# Altium project GameBoard_V1I1.PrjPcb (part 20 of 20)
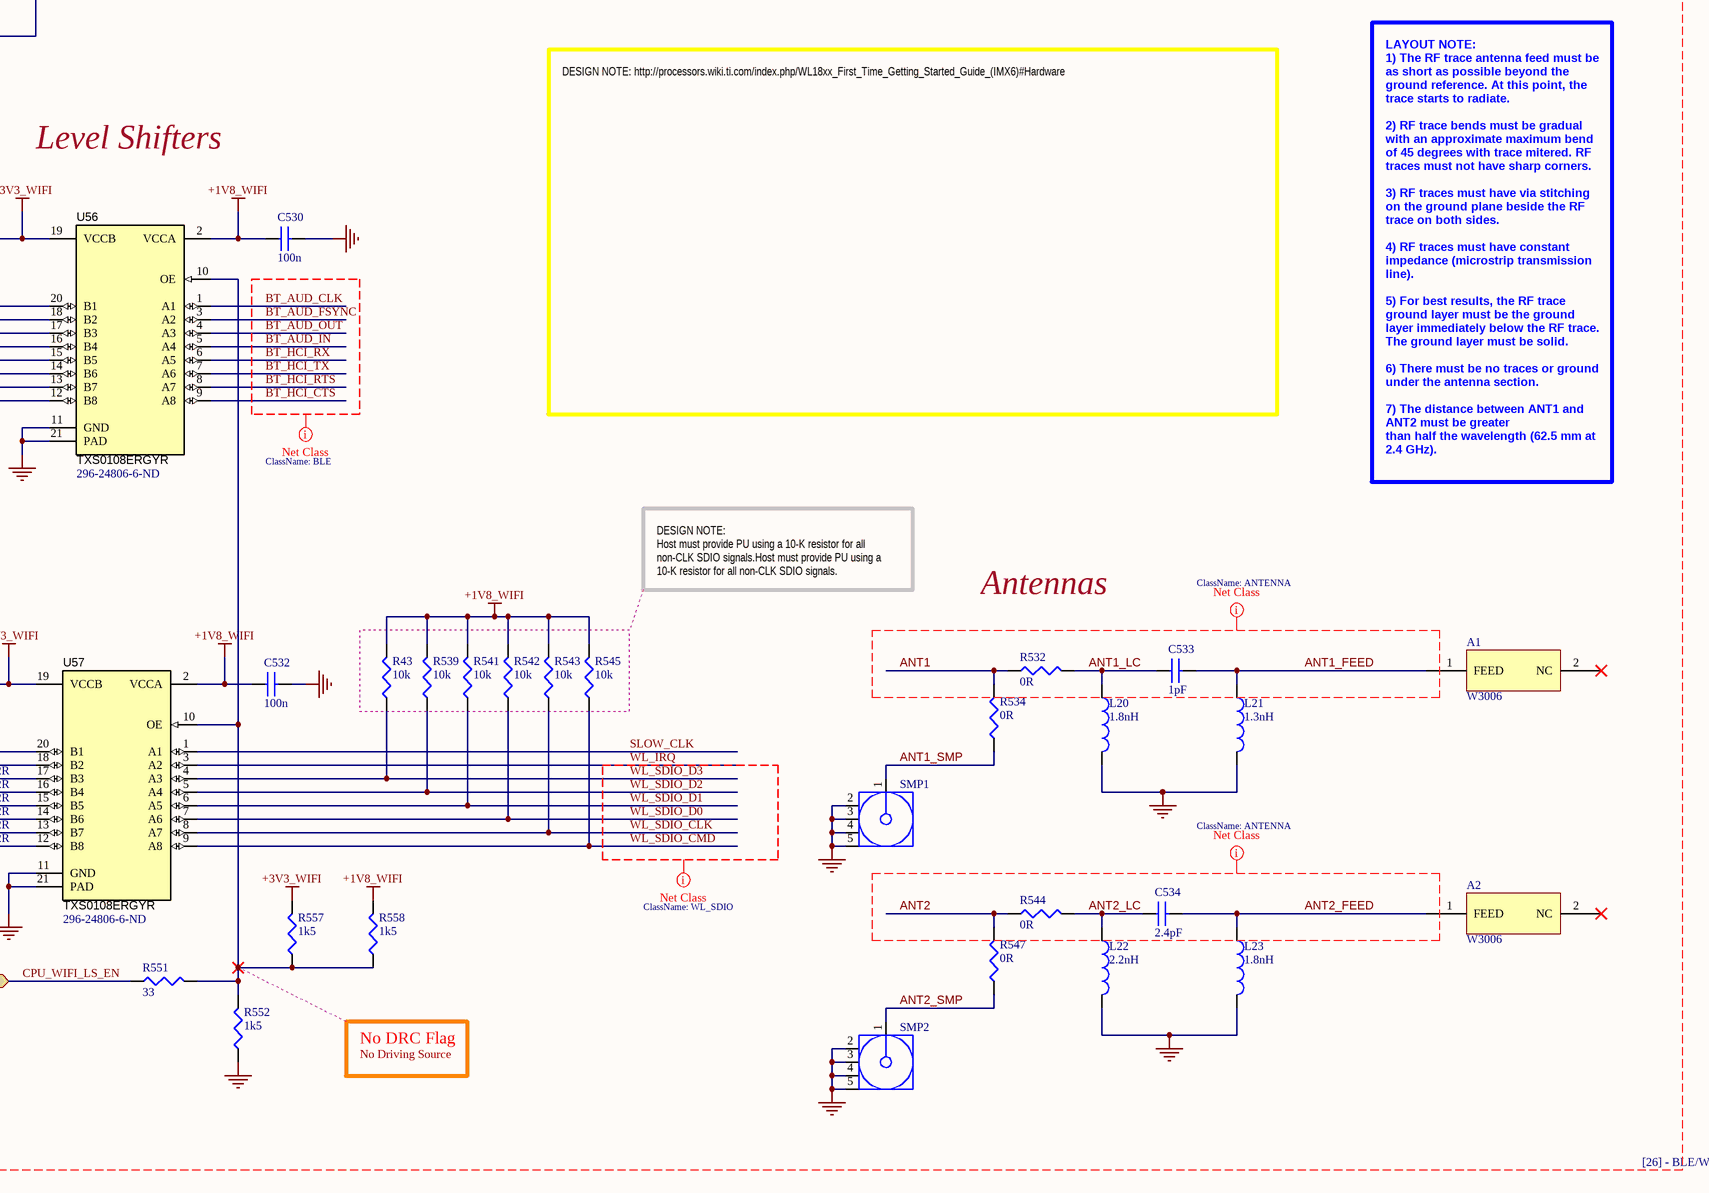
[diagram p96: [26] - BLE, WIFI.SchDoc, bottom right]

## Nets that join several sheets
+1V1_VDDSOC_CAP: [04] - CPU - PCIE, USB (C60.1 FB1.1 R12.1), [05] - CPU - HDMI, LVDS (C72.1 R22.1), [06] - CPU - ETHERNET, SATA (R39.1), [12] - CPU - POWER (16 pins)
+1V2_PMIC: [15] - ETHERNET PHY (R118.2), [30] - PWR PMIC (C419.1 TP27.1 U44.18)
+1V5_DDR: [03] - CPU - DDR3, DDR3 MEM (134 pins), [11] - CPU - JTAG, CONTROL (R90.2), [12] - CPU - POWER (13 pins), [18] - PCIE MINI (FB9.2), [30] - PWR PMIC (10 pins), [21] - AUDIO (FB17.1)
+1V8_AUDIO: [30] - PWR PMIC (C421.1 TP28.1 U44.26), [21] - AUDIO (FB16.2 FB18.2)
+1V375_CORE: [12] - CPU - POWER (28 pins), [15] - ETHERNET PHY (FB2.1), [30] - PWR PMIC (7 pins), [28] - PWR 1V375 OPT, 3V3 OPT (R299.2)
+1V375_SOC: [12] - CPU - POWER (21 pins), [30] - PWR PMIC (6 pins), [28] - PWR 1V375 OPT, 3V3 OPT (5 pins)
+2V5: [04] - CPU - PCIE, USB (C63.1 R13.1), [05] - CPU - HDMI, LVDS (C75.1 R27.1 R32.1), [06] - CPU - ETHERNET, SATA (C92.1 R40.1), [12] - CPU - POWER (C169.1 R114.2 R115.2 R116.2), [15] - ETHERNET PHY (FB6.1), [30] - PWR PMIC (C422.1 TP29.1 U44.28)
+3V0_ALWAYS: [11] - CPU - JTAG, CONTROL (13 pins), [12] - CPU - POWER (6 pins), [30] - PWR PMIC (5 pins), [28] - PWR 1V375 OPT, 3V3 OPT (R313.1)
+3V0_VSNVS: [27] - LEDS, BUTTONS (R426.2), [30] - PWR PMIC (C430.1 R433.2 R434.2 U44.43)
+3V3: [17] - LVDS, CSI (FB48.1), [04] - CPU - PCIE, USB (R14.2 R590.2 R625.2), [05] - CPU - HDMI, LVDS (16 pins), [08] - CPU - SPI, UART (R45.2), [10] - CPU - GPIO, PWM, LEDS, BUTTONS (6 pins), [09] - CPU - SD, AUDIO, I2C, CAN (10 pins), [11] - CPU - JTAG, CONTROL (13 pins), [12] - CPU - POWER (21 pins), [18] - PCIE MINI (5 pins), [15] - ETHERNET PHY (FB7.1 R122.1), [19] - USB (FB12.1 R173.2), [07] - CPU - CSI, FLASH (FB49.1), [14] - MCU (6 pins), [20] - ETHERNET, SATA (C266.1 C267.1 J8.14 J8.16), [27] - LEDS, BUTTONS (32 pins), [30] - PWR PMIC (13 pins), [22] - SD CARD, SPI, FLASH, EEPROM, (21 pins), [23] - SENSORS, CAN, IR (14 pins), [16] - HDMI (5 pins), [21] - AUDIO (C268.1 FB19.1 FB20.2), [24] - HEADERS, UART (26 pins), [25] - LCD,TSC (33 pins), [26] - BLE, WIFI (FB50.1)
+3V3_HDR: [24] - HEADERS, UART (D19.2 FB24.2), [28] - PWR 1V375 OPT, 3V3 OPT (7 pins), [26] - BLE, WIFI (FB51.1)
+3V3_LDO: [14] - MCU (FB36.1), [30] - PWR PMIC (C423.1 TP30.1 U44.39)
+3V3_MCU: [14] - MCU (14 pins), [27] - LEDS, BUTTONS (R417.2)
+5V: [04] - CPU - PCIE, USB (C70.1 C71.1 U1.D10 U1.E9), [18] - PCIE MINI (FB10.1), [19] - USB (C242.1 FB13.1 R183.1), [30] - PWR PMIC (6 pins), [23] - SENSORS, CAN, IR (FB33.1), [16] - HDMI (C218.1 U16.1), [24] - HEADERS, UART (FB31.2)
+5V_USB_OTG: [19] - USB (5 pins), [29] - PWR IN, MECH, DOC (FB42.2 Q10.3)
+BAT: [14] - MCU (R226.1), [31] - PWR BATTERY CHARGER (6 pins)
+DDR_VREF: [03] - CPU - DDR3, DDR3 MEM (22 pins), [30] - PWR PMIC (R430.1)
+SYS: [14] - MCU (R583.1), [29] - PWR IN, MECH, DOC (7 pins), [31] - PWR BATTERY CHARGER (9 pins)
+VBUS: [29] - PWR IN, MECH, DOC (J22.2 TP25.1), [31] - PWR BATTERY CHARGER (C481.1 C482.1 R468.2 U45.1)
+VIN_4V2: [15] - ETHERNET PHY (R119.1), [14] - MCU (R227.1), [30] - PWR PMIC (32 pins), [29] - PWR IN, MECH, DOC (C355.1 D24.1 TP22.1), [28] - PWR 1V375 OPT, 3V3 OPT (15 pins), [26] - BLE, WIFI (C523.1 R508.1 U54.3)
+VIN_5V: [18] - PCIE MINI (FB11.1), [19] - USB (C261.1 FB14.1 FB15.2 U19.7), [14] - MCU (R582.1), [29] - PWR IN, MECH, DOC (11 pins), [24] - HEADERS, UART (FB27.2), [25] - LCD,TSC (FB43.2)
GND: [17] - LVDS, CSI (10 pins), [04] - CPU - PCIE, USB (13 pins), [05] - CPU - HDMI, LVDS (44 pins), [06] - CPU - ETHERNET, SATA (C87.2 C92.2 C93.2 R41.1), [03] - CPU - DDR3, DDR3 MEM (149 pins), [11] - CPU - JTAG, CONTROL (26 pins), [12] - CPU - POWER (194 pins), [18] - PCIE MINI (42 pins), [15] - ETHERNET PHY (41 pins), [19] - USB (52 pins), [07] - CPU - CSI, FLASH (41 pins), [14] - MCU (24 pins), [20] - ETHERNET, SATA (13 pins), [27] - LEDS, BUTTONS (55 pins), [30] - PWR PMIC (66 pins), [29] - PWR IN, MECH, DOC (48 pins), [22] - SD CARD, SPI, FLASH, EEPROM, (18 pins), [23] - SENSORS, CAN, IR (56 pins), [16] - HDMI (28 pins), [21] - AUDIO (23 pins), [24] - HEADERS, UART (22 pins), [25] - LCD,TSC (74 pins), [31] - PWR BATTERY CHARGER (37 pins), [28] - PWR 1V375 OPT, 3V3 OPT (29 pins), [26] - BLE, WIFI (101 pins)
+PWRON_1V375_OPT: [30] - PWR PMIC (C418.1 U44.16), [28] - PWR 1V375 OPT, 3V3 OPT (R301.2)
AUD3_CLK: [09] - CPU - SD, AUDIO, I2C, CAN (R58.2), [21] - AUDIO (U20.21)
AUD3_RXD: [09] - CPU - SD, AUDIO, I2C, CAN (U1.N3), [21] - AUDIO (U20.25)
AUD3_TXC: [09] - CPU - SD, AUDIO, I2C, CAN (R57.2), [21] - AUDIO (U20.24)
AUD3_TXD: [09] - CPU - SD, AUDIO, I2C, CAN (U1.P2), [21] - AUDIO (U20.26)
AUD3_TXFS: [09] - CPU - SD, AUDIO, I2C, CAN (U1.N4), [21] - AUDIO (U20.23)
BL_PWM: [10] - CPU - GPIO, PWM, LEDS, BUTTONS (U1.B19), [25] - LCD,TSC (R329.2)
BUMP_L1: [27] - LEDS, BUTTONS (C407.1 R408.1), [25] - LCD,TSC (U43.19)
BUMP_L2: [27] - LEDS, BUTTONS (C406.1 R411.1), [25] - LCD,TSC (U43.20)
BUMP_R1: [27] - LEDS, BUTTONS (C409.1 R409.1), [25] - LCD,TSC (U43.21)
BUMP_R2: [27] - LEDS, BUTTONS (C408.1 R412.1), [25] - LCD,TSC (U43.22)
CAN_N: [23] - SENSORS, CAN, IR (C309.1 R246.1 R251.2 U26.6), [24] - HEADERS, UART (J12.8)
CAN_P: [23] - SENSORS, CAN, IR (C306.1 R241.2 R249.2 U26.7), [24] - HEADERS, UART (J12.9)
CHARGE_~{CE}: [10] - CPU - GPIO, PWM, LEDS, BUTTONS (U1.R22), [31] - PWR BATTERY CHARGER (R474.1 R480.2 TP50.1 U45.9)
CHARGE_INT: [10] - CPU - GPIO, PWM, LEDS, BUTTONS (U1.T25), [31] - PWR BATTERY CHARGER (R472.1 R481.2 TP48.1 U45.7)
COMP_INT: [10] - CPU - GPIO, PWM, LEDS, BUTTONS (R47.1 U1.N25), [23] - SENSORS, CAN, IR (R255.2 R257.2)
CPU_BT_EN: [09] - CPU - SD, AUDIO, I2C, CAN (U1.B20), [26] - BLE, WIFI (R623.1)
CPU_GPIO0: [10] - CPU - GPIO, PWM, LEDS, BUTTONS (U1.D18), [14] - MCU (R280.2)
CPU_GPIO1: [10] - CPU - GPIO, PWM, LEDS, BUTTONS (U1.E18), [14] - MCU (R281.2)
CPU_GPIO2: [10] - CPU - GPIO, PWM, LEDS, BUTTONS (U1.E23), [14] - MCU (R282.2)
CPU_WIFI_LS_EN: [09] - CPU - SD, AUDIO, I2C, CAN (U1.C19), [26] - BLE, WIFI (R551.1)
CPU_WL_EN: [09] - CPU - SD, AUDIO, I2C, CAN (U1.V6), [26] - BLE, WIFI (R546.1 R549.2)
CSI_CLK0_N: [17] - LVDS, CSI (R453.1), [07] - CPU - CSI, FLASH (U1.F4)
CSI_CLK0_P: [17] - LVDS, CSI (R457.1), [07] - CPU - CSI, FLASH (U1.F3)
CSI_D0_N: [17] - LVDS, CSI (R443.1), [07] - CPU - CSI, FLASH (U1.E4)
CSI_D0_P: [17] - LVDS, CSI (R445.1), [07] - CPU - CSI, FLASH (U1.E3)
CSI_D1_N: [17] - LVDS, CSI (R447.1), [07] - CPU - CSI, FLASH (U1.D1)
CSI_D1_P: [17] - LVDS, CSI (R449.1), [07] - CPU - CSI, FLASH (U1.D2)
CSI_GPIO0: [17] - LVDS, CSI (R461.1), [10] - CPU - GPIO, PWM, LEDS, BUTTONS (U1.A15)
CSI_GPIO1: [17] - LVDS, CSI (R463.1), [10] - CPU - GPIO, PWM, LEDS, BUTTONS (U1.B15)
CSPI1_CLK: [08] - CPU - SPI, UART (R42.2), [24] - HEADERS, UART (J14.3)
CSPI1_CS0: [08] - CPU - SPI, UART (U1.U20), [24] - HEADERS, UART (J14.4)
CSPI1_CS1: [08] - CPU - SPI, UART (U1.T22), [24] - HEADERS, UART (J14.5)
CSPI1_MISO: [08] - CPU - SPI, UART (U1.F21), [24] - HEADERS, UART (J14.2)
CSPI1_MOSI: [08] - CPU - SPI, UART (U1.D24), [24] - HEADERS, UART (J14.1)
CSPI2_RXD: [08] - CPU - SPI, UART (U1.U23), [26] - BLE, WIFI (R529.1)
CSPI2_TXC: [08] - CPU - SPI, UART (U1.T21), [26] - BLE, WIFI (R526.1)
CSPI2_TXD: [08] - CPU - SPI, UART (U1.U24), [26] - BLE, WIFI (R528.1)
CSPI2_TXFS: [08] - CPU - SPI, UART (U1.V25), [26] - BLE, WIFI (R527.1)
CSPI3_CLK: [08] - CPU - SPI, UART (R44.2), [22] - SD CARD, SPI, FLASH, EEPROM, (R216.2 TP16.1 U21.6 U23.4)
CSPI3_CS0: [08] - CPU - SPI, UART (U1.P21), [22] - SD CARD, SPI, FLASH, EEPROM, (R219.2 TP17.1 U23.7)
CSPI3_CS2: [08] - CPU - SPI, UART (U1.R25), [22] - SD CARD, SPI, FLASH, EEPROM, (TP18.1 U21.1)
CSPI3_MCU_CLK: [14] - MCU (U34.19), [22] - SD CARD, SPI, FLASH, EEPROM, (R216.1 U23.13)
CSPI3_MCU_CS0: [14] - MCU (U34.8), [22] - SD CARD, SPI, FLASH, EEPROM, (R219.1 U23.10)
CSPI3_MCU_ENn: [08] - CPU - SPI, UART (R45.1 U1.W20), [22] - SD CARD, SPI, FLASH, EEPROM, (U23.14 U23.15)
CSPI3_MCU_MISO: [14] - MCU (U34.17), [22] - SD CARD, SPI, FLASH, EEPROM, (R218.1 U23.6)
CSPI3_MCU_MOSI: [14] - MCU (U34.18), [22] - SD CARD, SPI, FLASH, EEPROM, (R217.1 U23.12)
CSPI3_MISO: [08] - CPU - SPI, UART (U1.P23), [22] - SD CARD, SPI, FLASH, EEPROM, (R218.2 TP15.1 U21.2 U23.11)
CSPI3_MOSI: [08] - CPU - SPI, UART (U1.P22), [22] - SD CARD, SPI, FLASH, EEPROM, (R217.2 TP14.1 U21.5 U23.5)
ENET_LED_LINK: [15] - ETHERNET PHY (R120.2), [20] - ETHERNET, SATA (J8.13)
ENET_LED_RX: [15] - ETHERNET PHY (R121.2), [20] - ETHERNET, SATA (R199.2 R200.2)
ENET_REF_CLK: [06] - CPU - ETHERNET, SATA (U1.V22), [15] - ETHERNET PHY (R123.2)
FLEXCAN1_RX: [09] - CPU - SD, AUDIO, I2C, CAN (U1.D14), [23] - SENSORS, CAN, IR (R250.1 U27.4)
FLEXCAN1_STBY: [09] - CPU - SD, AUDIO, I2C, CAN (R65.1 U1.D15), [23] - SENSORS, CAN, IR (Q6.1 R252.1)
FLEXCAN1_TX: [09] - CPU - SD, AUDIO, I2C, CAN (U1.B13), [23] - SENSORS, CAN, IR (R242.1 U24.1 U24.2)
GYRO_INT: [10] - CPU - GPIO, PWM, LEDS, BUTTONS (R46.1 U1.N22), [23] - SENSORS, CAN, IR (R256.2 R258.2)
HDMI_CEC_IN: [05] - CPU - HDMI, LVDS (R20.1 R24.2 R25.2), [16] - HDMI (U16.16)
HDMI_CLK_N: [05] - CPU - HDMI, LVDS (U7.9), [16] - HDMI (J1.12 U16.15 U16.24)
HDMI_CLK_P: [05] - CPU - HDMI, LVDS (U7.10), [16] - HDMI (J1.10 U16.13 U16.26)
HDMI_D0_N: [05] - CPU - HDMI, LVDS (U6.9), [16] - HDMI (J1.9 U16.12 U16.27)
HDMI_D0_P: [05] - CPU - HDMI, LVDS (U6.10), [16] - HDMI (J1.7 U16.10 U16.29)
HDMI_D1_N: [05] - CPU - HDMI, LVDS (U9.9), [16] - HDMI (J1.6 U16.9 U16.30)
HDMI_D1_P: [05] - CPU - HDMI, LVDS (U9.10), [16] - HDMI (J1.4 U16.7 U16.32)
HDMI_D2_N: [05] - CPU - HDMI, LVDS (U8.9), [16] - HDMI (J1.3 U16.6 U16.33)
HDMI_D2_P: [05] - CPU - HDMI, LVDS (U8.10), [16] - HDMI (J1.1 U16.4 U16.35)
HDMI_HPD: [05] - CPU - HDMI, LVDS (R23.2), [16] - HDMI (R150.2 U17.4)
I2C1_SCL: [09] - CPU - SD, AUDIO, I2C, CAN (R60.1 U1.H20), [30] - PWR PMIC (R441.1), [22] - SD CARD, SPI, FLASH, EEPROM, (U22.6), [23] - SENSORS, CAN, IR (U30.4 U31.11), [24] - HEADERS, UART (R224.1)
I2C1_SCL_MCU: [14] - MCU (R279.1 U34.10), [24] - HEADERS, UART (R225.1)
I2C1_SDA: [09] - CPU - SD, AUDIO, I2C, CAN (R59.1 U1.G23), [30] - PWR PMIC (R442.1), [22] - SD CARD, SPI, FLASH, EEPROM, (U22.5), [23] - SENSORS, CAN, IR (U30.6 U31.12), [24] - HEADERS, UART (R222.1)
I2C1_SDA_MCU: [14] - MCU (R278.1 U34.11), [24] - HEADERS, UART (R223.1)
I2C2_SCL: [17] - LVDS, CSI (R454.1), [09] - CPU - SD, AUDIO, I2C, CAN (R62.1 U1.U5), [18] - PCIE MINI (J2.30), [23] - SENSORS, CAN, IR (U25.1 U28.6), [16] - HDMI (U16.17), [21] - AUDIO (U20.29), [24] - HEADERS, UART (J14.7), [31] - PWR BATTERY CHARGER (U45.5 U46.5)
I2C2_SDA: [17] - LVDS, CSI (R456.1), [09] - CPU - SD, AUDIO, I2C, CAN (R61.1 U1.T7), [18] - PCIE MINI (J2.32), [23] - SENSORS, CAN, IR (U25.6 U28.1), [16] - HDMI (U16.18), [21] - AUDIO (U20.27), [24] - HEADERS, UART (J14.6), [31] - PWR BATTERY CHARGER (U45.6 U46.6)
I2C3_SCL: [09] - CPU - SD, AUDIO, I2C, CAN (R64.1 U1.R4), [24] - HEADERS, UART (R577.1), [25] - LCD,TSC (U43.16)
I2C3_SDA: [09] - CPU - SD, AUDIO, I2C, CAN (R63.1 U1.R2), [24] - HEADERS, UART (R576.1), [25] - LCD,TSC (U43.17)
IR_RCV: [10] - CPU - GPIO, PWM, LEDS, BUTTONS (U1.A20), [23] - SENSORS, CAN, IR (U29.1)
LCD_HDMI_CLK_N: [05] - CPU - HDMI, LVDS (U7.12), [25] - LCD,TSC (U42.94)
LCD_HDMI_CLK_P: [05] - CPU - HDMI, LVDS (U7.13), [25] - LCD,TSC (U42.93)
LCD_HDMI_D0_N: [05] - CPU - HDMI, LVDS (U6.12), [25] - LCD,TSC (U42.91)
LCD_HDMI_D0_P: [05] - CPU - HDMI, LVDS (U6.13), [25] - LCD,TSC (U42.90)
LCD_HDMI_D1_N: [05] - CPU - HDMI, LVDS (U9.12), [25] - LCD,TSC (U42.86)
LCD_HDMI_D1_P: [05] - CPU - HDMI, LVDS (U9.13), [25] - LCD,TSC (U42.85)
LCD_HDMI_D2_N: [05] - CPU - HDMI, LVDS (U8.12), [25] - LCD,TSC (U42.81)
LCD_HDMI_D2_P: [05] - CPU - HDMI, LVDS (U8.13), [25] - LCD,TSC (U42.80)
LVDS0_CLK_N: [17] - LVDS, CSI (R462.1), [05] - CPU - HDMI, LVDS (U1.V4)
LVDS0_CLK_P: [17] - LVDS, CSI (R464.1), [05] - CPU - HDMI, LVDS (U1.V3)
LVDS0_TX0_N: [17] - LVDS, CSI (R444.1), [05] - CPU - HDMI, LVDS (U1.U2)
LVDS0_TX0_P: [17] - LVDS, CSI (R446.1), [05] - CPU - HDMI, LVDS (U1.U1)
LVDS0_TX1_N: [17] - LVDS, CSI (R448.1), [05] - CPU - HDMI, LVDS (U1.U4)
LVDS0_TX1_P: [17] - LVDS, CSI (R450.1), [05] - CPU - HDMI, LVDS (U1.U3)
LVDS0_TX2_N: [17] - LVDS, CSI (R455.1), [05] - CPU - HDMI, LVDS (U1.V2)
LVDS0_TX2_P: [17] - LVDS, CSI (R460.1), [05] - CPU - HDMI, LVDS (U1.V1)
LVDS0_TX3_N: [17] - LVDS, CSI (TP42.1), [05] - CPU - HDMI, LVDS (U1.W2)
LVDS0_TX3_P: [17] - LVDS, CSI (TP43.1), [05] - CPU - HDMI, LVDS (U1.W1)
MCU_BTN: [14] - MCU (R287.2), [27] - LEDS, BUTTONS (C410.1 D43.1 R420.1)
MCU_ISPn: [10] - CPU - GPIO, PWM, LEDS, BUTTONS (R50.1 U1.J24), [14] - MCU (R273.2)
MCU_RSTINn: [10] - CPU - GPIO, PWM, LEDS, BUTTONS (R49.1 U1.J23), [14] - MCU (U33.1 U33.2)
MCU_RSTOUTn: [11] - CPU - JTAG, CONTROL (R93.1), [14] - MCU (U34.16)
MCU_SWDIO: [10] - CPU - GPIO, PWM, LEDS, BUTTONS (TP2.1 U1.P1), [14] - MCU (U35.3)
MCU_SWDIO_SEL: [10] - CPU - GPIO, PWM, LEDS, BUTTONS (R51.1 U1.N2), [14] - MCU (U35.6)
MOV_LD: [27] - LEDS, BUTTONS (C398.1 R381.1), [25] - LCD,TSC (U43.39)
MOV_LL: [27] - LEDS, BUTTONS (C397.1 R383.1), [25] - LCD,TSC (U43.40)
MOV_LR: [27] - LEDS, BUTTONS (C396.1 R388.1), [25] - LCD,TSC (U43.41)
MOV_LU: [27] - LEDS, BUTTONS (C399.1 R380.1), [25] - LCD,TSC (U43.38)
MOV_RD: [27] - LEDS, BUTTONS (C404.1 R400.1), [25] - LCD,TSC (U43.3)
MOV_RL: [27] - LEDS, BUTTONS (C403.1 R402.1), [25] - LCD,TSC (U43.4)
MOV_RR: [27] - LEDS, BUTTONS (C402.1 R403.1), [25] - LCD,TSC (U43.5)
MOV_RU: [27] - LEDS, BUTTONS (C405.1 R398.1), [25] - LCD,TSC (U43.2)
PCIE_CLK_N: [04] - CPU - PCIE, USB (C66.2 R17.2), [18] - PCIE MINI (J2.11)
PCIE_CLK_P: [04] - CPU - PCIE, USB (C67.2 R16.2), [18] - PCIE MINI (J2.13)
PCIE_RSTn: [11] - CPU - JTAG, CONTROL (R108.2 R110.1), [18] - PCIE MINI (J2.22)
PCIE_RSTn_R: [04] - CPU - PCIE, USB (R18.1 R674.1), [11] - CPU - JTAG, CONTROL (R110.2)
PCIE_RX_N: [04] - CPU - PCIE, USB (U1.B1), [18] - PCIE MINI (J2.23)
PCIE_RX_P: [04] - CPU - PCIE, USB (U1.B2), [18] - PCIE MINI (J2.25)
PCIE_TX_N: [04] - CPU - PCIE, USB (C62.2), [18] - PCIE MINI (J2.31)
PCIE_TX_P: [04] - CPU - PCIE, USB (C65.2), [18] - PCIE MINI (J2.33)
PCIE_WAKE: [04] - CPU - PCIE, USB (U1.P3), [18] - PCIE MINI (J2.1 R151.1)
PCIE_WDISn: [04] - CPU - PCIE, USB (R14.1 U1.R1), [18] - PCIE MINI (J2.20)
PMIC_INT: [11] - CPU - JTAG, CONTROL (U1.T24), [30] - PWR PMIC (R435.1 R439.2 U44.1)
PMIC_STBY_REQ: [11] - CPU - JTAG, CONTROL (D1.2), [14] - MCU (D23.2), [30] - PWR PMIC (R434.1 R440.2 U44.4)
POK_1V375_OPT: [11] - CPU - JTAG, CONTROL (R107.1), [28] - PWR 1V375 OPT, 3V3 OPT (U36.3)
POK_3V3_OPT: [11] - CPU - JTAG, CONTROL (R102.1), [28] - PWR 1V375 OPT, 3V3 OPT (R313.2 U37.3)
POK_PMIC: [11] - CPU - JTAG, CONTROL (R100.1), [30] - PWR PMIC (R437.1 U44.3), [28] - PWR 1V375 OPT, 3V3 OPT (R312.2)
POK_SYS: [11] - CPU - JTAG, CONTROL (5 pins), [15] - ETHERNET PHY (U15.9), [27] - LEDS, BUTTONS (Q16.1)
PWRON: [11] - CPU - JTAG, CONTROL (D2.2), [27] - LEDS, BUTTONS (D44.2), [30] - PWR PMIC (R433.1 TP39.1 U44.56)
RGMII_INT: [06] - CPU - ETHERNET, SATA (R38.2 U1.W22), [15] - ETHERNET PHY (R130.1 TP10.1 U14.38)
RGMII_MDC: [06] - CPU - ETHERNET, SATA (U1.V20), [15] - ETHERNET PHY (R126.1 R128.1)
RGMII_MDIO: [06] - CPU - ETHERNET, SATA (U1.V23), [15] - ETHERNET PHY (R127.1 R129.1)
RGMII_RSTn: [11] - CPU - JTAG, CONTROL (D3.2 R112.1), [15] - ETHERNET PHY (R131.1 U14.42)
RGMII_RXCLK: [06] - CPU - ETHERNET, SATA (U1.B25), [15] - ETHERNET PHY (R124.1)
RGMII_RXD0: [06] - CPU - ETHERNET, SATA (U1.C24), [15] - ETHERNET PHY (R137.1 U14.32)
RGMII_RXD1: [06] - CPU - ETHERNET, SATA (U1.B23), [15] - ETHERNET PHY (R136.1 U14.31)
RGMII_RXD2: [06] - CPU - ETHERNET, SATA (U1.B24), [15] - ETHERNET PHY (R135.1 U14.28)
RGMII_RXD3: [06] - CPU - ETHERNET, SATA (U1.D23), [15] - ETHERNET PHY (R134.1 U14.27)
RGMII_RXDV: [06] - CPU - ETHERNET, SATA (U1.D22), [15] - ETHERNET PHY (R132.1 U14.33)
RGMII_TXCLK: [06] - CPU - ETHERNET, SATA (R37.2), [15] - ETHERNET PHY (U14.24)
RGMII_TXD0: [06] - CPU - ETHERNET, SATA (U1.C22), [15] - ETHERNET PHY (U14.19)
RGMII_TXD1: [06] - CPU - ETHERNET, SATA (U1.F20), [15] - ETHERNET PHY (U14.20)
RGMII_TXD2: [06] - CPU - ETHERNET, SATA (U1.E21), [15] - ETHERNET PHY (U14.21)
RGMII_TXD3: [06] - CPU - ETHERNET, SATA (U1.A24), [15] - ETHERNET PHY (U14.22)
RGMII_TXEN: [06] - CPU - ETHERNET, SATA (U1.C23), [15] - ETHERNET PHY (U14.25)
RST_BTN_HDR: [27] - LEDS, BUTTONS (R425.1 R426.1 R427.2 SW23.2), [24] - HEADERS, UART (J12.7)
RSTINn: [11] - CPU - JTAG, CONTROL (R88.1 U10.1), [27] - LEDS, BUTTONS (R429.2)
RSTOUTn: [11] - CPU - JTAG, CONTROL (R101.2 U12.4), [19] - USB (R189.2), [14] - MCU (R271.2), [29] - PWR IN, MECH, DOC (R322.2), [23] - SENSORS, CAN, IR (R268.1 U32.2), [24] - HEADERS, UART (J14.9)
SATA_RX_N: [06] - CPU - ETHERNET, SATA (C88.2), [20] - ETHERNET, SATA (J9.5)
SATA_RX_P: [06] - CPU - ETHERNET, SATA (C89.2), [20] - ETHERNET, SATA (J9.6)
SATA_TX_N: [06] - CPU - ETHERNET, SATA (C90.2), [20] - ETHERNET, SATA (J9.3)
SATA_TX_P: [06] - CPU - ETHERNET, SATA (C91.2), [20] - ETHERNET, SATA (J9.2)
SD1_CLK_BOOT: [09] - CPU - SD, AUDIO, I2C, CAN (R601.1), [22] - SD CARD, SPI, FLASH, EEPROM, (R618.1)
SD1_CLK_WIFI: [09] - CPU - SD, AUDIO, I2C, CAN (R602.1), [26] - BLE, WIFI (R572.1)
SD1_CMD_BOOT: [09] - CPU - SD, AUDIO, I2C, CAN (R599.1), [22] - SD CARD, SPI, FLASH, EEPROM, (R616.1)
SD1_CMD_WIFI: [09] - CPU - SD, AUDIO, I2C, CAN (R600.1), [26] - BLE, WIFI (R570.1)
SD1_DATA0_BOOT: [09] - CPU - SD, AUDIO, I2C, CAN (R591.1), [22] - SD CARD, SPI, FLASH, EEPROM, (R221.1)
SD1_DATA0_WIFI: [09] - CPU - SD, AUDIO, I2C, CAN (R592.1), [26] - BLE, WIFI (R562.1)
SD1_DATA1_BOOT: [09] - CPU - SD, AUDIO, I2C, CAN (R593.1), [22] - SD CARD, SPI, FLASH, EEPROM, (R230.1)
SD1_DATA1_WIFI: [09] - CPU - SD, AUDIO, I2C, CAN (R594.1), [26] - BLE, WIFI (R564.1)
SD1_DATA2_BOOT: [09] - CPU - SD, AUDIO, I2C, CAN (R595.1), [22] - SD CARD, SPI, FLASH, EEPROM, (R560.1)
SD1_DATA2_WIFI: [09] - CPU - SD, AUDIO, I2C, CAN (R596.1), [26] - BLE, WIFI (R566.1)
SD1_DATA3_BOOT: [09] - CPU - SD, AUDIO, I2C, CAN (R597.1), [22] - SD CARD, SPI, FLASH, EEPROM, (R580.1)
SD1_DATA3_WIFI: [09] - CPU - SD, AUDIO, I2C, CAN (R598.1), [26] - BLE, WIFI (R568.1)
SD2_ACT: [09] - CPU - SD, AUDIO, I2C, CAN (U1.T3), [22] - SD CARD, SPI, FLASH, EEPROM, (Q3.1)
SD2_BT_EN: [09] - CPU - SD, AUDIO, I2C, CAN (R621.1), [26] - BLE, WIFI (R624.1)
SD2_CD: [09] - CPU - SD, AUDIO, I2C, CAN (R53.1 U1.R6), [22] - SD CARD, SPI, FLASH, EEPROM, (Q2.3)
SD2_CLK_BOOT: [09] - CPU - SD, AUDIO, I2C, CAN (R613.1), [22] - SD CARD, SPI, FLASH, EEPROM, (R619.1)
SD2_CLK_WIFI: [09] - CPU - SD, AUDIO, I2C, CAN (R614.1), [26] - BLE, WIFI (R573.1)
SD2_CMD_BOOT: [09] - CPU - SD, AUDIO, I2C, CAN (R611.1), [22] - SD CARD, SPI, FLASH, EEPROM, (R617.1)
SD2_CMD_WIFI: [09] - CPU - SD, AUDIO, I2C, CAN (R612.1), [26] - BLE, WIFI (R571.1)
SD2_DATA0_BOOT: [09] - CPU - SD, AUDIO, I2C, CAN (R603.1), [22] - SD CARD, SPI, FLASH, EEPROM, (R229.1)
SD2_DATA0_WIFI: [09] - CPU - SD, AUDIO, I2C, CAN (R604.1), [26] - BLE, WIFI (R563.1)
SD2_DATA1_BOOT: [09] - CPU - SD, AUDIO, I2C, CAN (R605.1), [22] - SD CARD, SPI, FLASH, EEPROM, (R559.1)
SD2_DATA1_WIFI: [09] - CPU - SD, AUDIO, I2C, CAN (R606.1), [26] - BLE, WIFI (R565.1)
SD2_DATA2_BOOT: [09] - CPU - SD, AUDIO, I2C, CAN (R607.1), [22] - SD CARD, SPI, FLASH, EEPROM, (R561.1)
SD2_DATA2_WIFI: [09] - CPU - SD, AUDIO, I2C, CAN (R608.1), [26] - BLE, WIFI (R567.1)
SD2_DATA3_BOOT: [09] - CPU - SD, AUDIO, I2C, CAN (R609.1), [22] - SD CARD, SPI, FLASH, EEPROM, (R615.1)
SD2_DATA3_WIFI: [09] - CPU - SD, AUDIO, I2C, CAN (R610.1), [26] - BLE, WIFI (R569.1)
SD2_WP_BOOT: [09] - CPU - SD, AUDIO, I2C, CAN (R620.1), [22] - SD CARD, SPI, FLASH, EEPROM, (R208.2 R622.1)
SEL_L1: [27] - LEDS, BUTTONS (C415.1 R424.1), [25] - LCD,TSC (U43.27)
SEL_L2: [27] - LEDS, BUTTONS (C414.1 R428.1), [25] - LCD,TSC (U43.26)
SEL_R1: [27] - LEDS, BUTTONS (C412.1 R419.1), [25] - LCD,TSC (U43.23)
SEL_R2: [27] - LEDS, BUTTONS (C411.1 R421.1), [25] - LCD,TSC (U43.24)
SRC_BOOT_CFG_00: [06] - CPU - ETHERNET, SATA (U1.L20), [24] - HEADERS, UART (R642.1)
SRC_BOOT_CFG_01: [06] - CPU - ETHERNET, SATA (U1.J25), [24] - HEADERS, UART (R643.1)
SRC_BOOT_CFG_02: [06] - CPU - ETHERNET, SATA (U1.L21), [24] - HEADERS, UART (R644.1)
SRC_BOOT_CFG_03: [06] - CPU - ETHERNET, SATA (U1.K24), [24] - HEADERS, UART (R645.1)
SRC_BOOT_CFG_04: [06] - CPU - ETHERNET, SATA (U1.L22), [24] - HEADERS, UART (R646.1)
SRC_BOOT_CFG_05: [06] - CPU - ETHERNET, SATA (U1.L23), [24] - HEADERS, UART (R647.1)
SRC_BOOT_CFG_06: [06] - CPU - ETHERNET, SATA (U1.K25), [24] - HEADERS, UART (R648.1)
SRC_BOOT_CFG_07: [06] - CPU - ETHERNET, SATA (U1.L25), [24] - HEADERS, UART (R649.1)
SRC_BOOT_CFG_08: [06] - CPU - ETHERNET, SATA (U1.L24), [24] - HEADERS, UART (R650.1)
SRC_BOOT_CFG_09: [06] - CPU - ETHERNET, SATA (U1.M21), [24] - HEADERS, UART (R651.1)
SRC_BOOT_CFG_10: [06] - CPU - ETHERNET, SATA (U1.M22), [24] - HEADERS, UART (R652.1)
SRC_BOOT_CFG_11: [06] - CPU - ETHERNET, SATA (U1.M20), [24] - HEADERS, UART (R653.1)
SRC_BOOT_CFG_12: [06] - CPU - ETHERNET, SATA (U1.M24), [24] - HEADERS, UART (R654.1)
SRC_BOOT_CFG_13: [06] - CPU - ETHERNET, SATA (U1.M23), [24] - HEADERS, UART (R655.1)
SRC_BOOT_CFG_14: [06] - CPU - ETHERNET, SATA (U1.N23), [24] - HEADERS, UART (R656.1)
SRC_BOOT_CFG_15: [06] - CPU - ETHERNET, SATA (U1.N24), [24] - HEADERS, UART (R657.1)
SRC_BOOT_CFG_16: [06] - CPU - ETHERNET, SATA (U1.H25), [24] - HEADERS, UART (R658.1)
SRC_BOOT_CFG_17: [06] - CPU - ETHERNET, SATA (U1.G24), [24] - HEADERS, UART (R661.1)
SRC_BOOT_CFG_18: [06] - CPU - ETHERNET, SATA (U1.J22), [24] - HEADERS, UART (R660.1)
SRC_BOOT_CFG_19: [06] - CPU - ETHERNET, SATA (U1.G25), [24] - HEADERS, UART (R659.1)
SRC_BOOT_CFG_20: [06] - CPU - ETHERNET, SATA (U1.H22), [24] - HEADERS, UART (R662.1)
SRC_BOOT_CFG_21: [06] - CPU - ETHERNET, SATA (U1.H23), [24] - HEADERS, UART (R663.1)
SRC_BOOT_CFG_22: [06] - CPU - ETHERNET, SATA (U1.F24), [24] - HEADERS, UART (R664.1)
SRC_BOOT_CFG_23: [06] - CPU - ETHERNET, SATA (U1.J21), [24] - HEADERS, UART (R665.1)
SRC_BOOT_CFG_24: [06] - CPU - ETHERNET, SATA (U1.F25), [24] - HEADERS, UART (R666.1)
SRC_BOOT_CFG_25: [06] - CPU - ETHERNET, SATA (U1.M25), [24] - HEADERS, UART (R667.1)
SRC_BOOT_CFG_26: [06] - CPU - ETHERNET, SATA (U1.K22), [24] - HEADERS, UART (R668.1)
SRC_BOOT_CFG_27: [06] - CPU - ETHERNET, SATA (U1.K21), [24] - HEADERS, UART (R669.1)
SRC_BOOT_CFG_28: [06] - CPU - ETHERNET, SATA (U1.K23), [24] - HEADERS, UART (R670.1)
SRC_BOOT_CFG_29: [06] - CPU - ETHERNET, SATA (U1.K20), [24] - HEADERS, UART (R671.1)
SRC_BOOT_CFG_30: [06] - CPU - ETHERNET, SATA (U1.E22), [24] - HEADERS, UART (R672.1)
TEMP_ALERT: [10] - CPU - GPIO, PWM, LEDS, BUTTONS (R48.1 U1.E24), [23] - SENSORS, CAN, IR (U25.3)
TRD0_N: [15] - ETHERNET PHY (U14.3), [20] - ETHERNET, SATA (J8.10)
TRD0_P: [15] - ETHERNET PHY (U14.2), [20] - ETHERNET, SATA (J8.11)
TRD1_N: [15] - ETHERNET PHY (U14.6), [20] - ETHERNET, SATA (J8.5)
TRD1_P: [15] - ETHERNET PHY (U14.5), [20] - ETHERNET, SATA (J8.4)
TRD2_N: [15] - ETHERNET PHY (U14.8), [20] - ETHERNET, SATA (J8.2)
TRD2_P: [15] - ETHERNET PHY (U14.7), [20] - ETHERNET, SATA (J8.3)
TRD3_N: [15] - ETHERNET PHY (U14.11), [20] - ETHERNET, SATA (J8.9)
TRD3_P: [15] - ETHERNET PHY (U14.10), [20] - ETHERNET, SATA (J8.8)
TS_X+: [14] - MCU (C333.1 FB38.2), [25] - LCD,TSC (D30.5 LCD1.37)
TS_X-: [14] - MCU (C334.1 FB39.2), [25] - LCD,TSC (D30.1 LCD1.38)
TS_Y+: [14] - MCU (C336.1 FB41.2), [25] - LCD,TSC (D30.4 LCD1.40)
TS_Y-: [14] - MCU (C335.1 FB40.2), [25] - LCD,TSC (D30.3 LCD1.39)
UART1_CTS: [08] - CPU - SPI, UART (U1.G21), [24] - HEADERS, UART (Q5.4 R236.1 R239.1)
UART1_RTS: [08] - CPU - SPI, UART (U1.G20), [24] - HEADERS, UART (Q5.1 R237.1 R240.1)
UART1_RXD: [08] - CPU - SPI, UART (U1.M3), [24] - HEADERS, UART (Q4.1 R231.1 R234.1)
UART1_TXD: [08] - CPU - SPI, UART (U1.M1), [24] - HEADERS, UART (Q4.4 R232.1 R235.1)
UART2_RXD: [08] - CPU - SPI, UART (U1.D13), [14] - MCU (TP19.1 U34.32)
UART2_TXD: [08] - CPU - SPI, UART (U1.C13), [14] - MCU (TP20.1 U34.31)
UART3_CTS: [08] - CPU - SPI, UART (U1.D25), [26] - BLE, WIFI (R531.1)
UART3_RTS: [08] - CPU - SPI, UART (U1.F23), [24] - HEADERS, UART (R673.1), [26] - BLE, WIFI (R530.1)
UART3_RXD: [08] - CPU - SPI, UART (U1.G22), [26] - BLE, WIFI (R585.1)
UART3_TXD: [08] - CPU - SPI, UART (U1.F22), [26] - BLE, WIFI (R584.1)
UART5_CTS: [04] - CPU - PCIE, USB (R581.1), [26] - BLE, WIFI (R628.1)
UART5_RTS: [04] - CPU - PCIE, USB (R626.2), [26] - BLE, WIFI (R627.1)
UART5_RXD: [08] - CPU - SPI, UART (U1.U6), [26] - BLE, WIFI (R220.1)
UART5_TXD: [08] - CPU - SPI, UART (U1.U7), [26] - BLE, WIFI (R586.1)
USB0_ID: [04] - CPU - PCIE, USB (U1.T4), [19] - USB (D10.1 J5.4 R173.1 R176.2), [29] - PWR IN, MECH, DOC (U39.2)
USB0_ID_BUFF_EN: [04] - CPU - PCIE, USB (R19.2 U1.H21), [29] - PWR IN, MECH, DOC (R325.2)
USB0_N: [04] - CPU - PCIE, USB (U1.B6), [19] - USB (R160.2 R162.2)
USB0_P: [04] - CPU - PCIE, USB (U1.A6), [19] - USB (R167.2 R168.2)
USB1_N: [04] - CPU - PCIE, USB (U1.F10), [19] - USB (R170.2 R171.2)
USB1_P: [04] - CPU - PCIE, USB (U1.E10), [19] - USB (R174.2 R175.2)
USB_HDR_N: [19] - USB (R159.2 R161.2), [24] - HEADERS, UART (L5.3)
USB_HDR_P: [19] - USB (R163.1 R166.2), [24] - HEADERS, UART (L5.4)
USB_LCDCTP_N: [19] - USB (R158.2 R159.1), [25] - LCD,TSC (U43.42)
USB_LCDCTP_P: [19] - USB (R165.2 R166.1), [25] - LCD,TSC (U43.43)
USB_MCU_N: [19] - USB (R178.2 R179.2), [14] - MCU (R275.2)
USB_MCU_P: [19] - USB (R180.1 R182.2), [14] - MCU (R274.2 R276.2)
USB_MPCIE_N: [18] - PCIE MINI (L1.4), [19] - USB (R177.2 R178.1)
USB_MPCIE_P: [18] - PCIE MINI (L1.3), [19] - USB (R181.2 R182.1)
USBCh_OTG_N: [29] - PWR IN, MECH, DOC (L9.4), [31] - PWR BATTERY CHARGER (U45.3)
USBCh_OTG_P: [29] - PWR IN, MECH, DOC (L9.3), [31] - PWR BATTERY CHARGER (U45.2)
USER_BTN_1: [10] - CPU - GPIO, PWM, LEDS, BUTTONS (U1.E13), [27] - LEDS, BUTTONS (D43.2 R418.1)
USER_BTN_2: [10] - CPU - GPIO, PWM, LEDS, BUTTONS (U1.F13), [27] - LEDS, BUTTONS (C400.1 R397.1)
USER_BTN_3: [10] - CPU - GPIO, PWM, LEDS, BUTTONS (U1.N21), [27] - LEDS, BUTTONS (C401.1 R401.1)
USER_LED: [10] - CPU - GPIO, PWM, LEDS, BUTTONS (U1.D19), [27] - LEDS, BUTTONS (Q17.1)
USER_LED_1: [10] - CPU - GPIO, PWM, LEDS, BUTTONS (U1.N19), [14] - MCU (U34.30), [27] - LEDS, BUTTONS (R382.2)
USER_LED_2: [10] - CPU - GPIO, PWM, LEDS, BUTTONS (U1.N20), [14] - MCU (R285.2), [27] - LEDS, BUTTONS (R384.2)
USER_LED_3: [10] - CPU - GPIO, PWM, LEDS, BUTTONS (U1.T23), [14] - MCU (R286.2), [27] - LEDS, BUTTONS (R385.2)
USER_LED_4: [10] - CPU - GPIO, PWM, LEDS, BUTTONS (U1.R23), [14] - MCU (R288.2), [27] - LEDS, BUTTONS (R386.2)
USER_LED_5: [10] - CPU - GPIO, PWM, LEDS, BUTTONS (U1.R20), [27] - LEDS, BUTTONS (R387.2)
USER_LED_6: [10] - CPU - GPIO, PWM, LEDS, BUTTONS (U1.R21), [27] - LEDS, BUTTONS (R389.2)
USER_LED_7: [10] - CPU - GPIO, PWM, LEDS, BUTTONS (U1.U22), [27] - LEDS, BUTTONS (R390.2)
USER_LED_8: [10] - CPU - GPIO, PWM, LEDS, BUTTONS (U1.T20), [27] - LEDS, BUTTONS (R391.2)
VPP/MCLR: [10] - CPU - GPIO, PWM, LEDS, BUTTONS (U1.F17), [25] - LCD,TSC (R368.1 TP56.1 U43.18)
WIFI_IRQ: [09] - CPU - SD, AUDIO, I2C, CAN (U1.W5), [26] - BLE, WIFI (U57.18)
XTALOSC_REF_CLK_32K: [09] - CPU - SD, AUDIO, I2C, CAN (U1.R5), [26] - BLE, WIFI (U57.20)

## Assembly variants
Prototype: not fitted C230 C231 C242 C248 C261 C320 C322 C333 C334 C335 C336 C341 C342 C348 C349 C362 C470 C477 C481 C485 C486 C489 C495 C496 D1 D2 D16 D17 D18 D19 D20 D21 D23 D44 D46 D47 D48 D52 D53 FB2 FB10 FB13 FB16 FB17 FB28 FB31 FB32 FB36 FB38 FB39 FB40 FB41 FB42 FB51 FIRMWARE_FOR_CARD_IN_J1 FIRMWARE_FOR_U1 JP3 L13 L20 LINK1 LINK2 LINK3 LINK4 PCB1 Q7 R8 R11 R21 R25 R34 R68 R70 R71 R72 R77 R78 R81 R82 R88 R93 R94 R96 R97 R99 R100 R108 R117 R122 R128 R142 R150 R151 R152 R153 R159 R160 R161 R163 R166 R167 R170 R174 R176 R178 R179 R180 R182 R183 R185 R187 R199 R201 R214 R220 R221 R226 R227 R228 R230 R232 R234 R235 R237 R239 R240 R242 R243 R249 R250 R251 R252 R253 R256 R262 R263 R265 R266 R271 R272 R274 R277 R278 R279 R284 R288 R289 R290 R291 R292 R293 R297 R298 R299 R304 R308 R309 R310 R316 R319 R325 R326 R330 R345 R348 R351 R416 R426 R431 R432 R434 R439 R444 R446 R448 R450 R451 R452 R455 R458 R459 R460 R462 R464 R466 R468 R478 R479 R483 R493 R496 R497 R500 R502 R504 R510 R524 R525 R534 R543 R547 R553 R554 R555 R556 R557 R558 R560 R562 R564 R566 R568 R570 R572 R575 R576 R577 R580 R581 R582 R583 R586 R589 R592 R594 R596 R598 R600 R602 R603 R605 R607 R609 R611 R613 R616 R618 R620 R622 R623 R626 R627 R628 R674 R676 R679 SMP1 SMP2 U19 U23